# Altium project ife19_TS_BMS_MasterLTC6820.PrjPCB
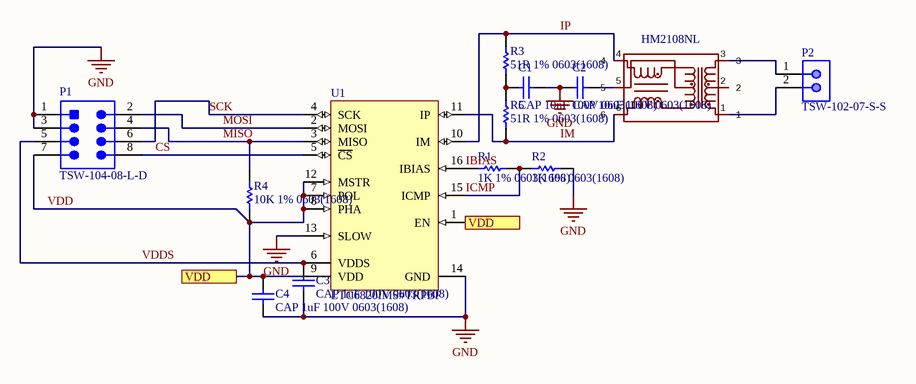
[diagram p0: ife19_TS_BMS_MasterLTC6820.SchDoc]
1 sheet, 13 parts. Net scope: flat (ports and power ports of the same name join across sheets).
Board file: ife19_TS_BMS_MasterLTC6820.PcbDoc

## Sheet ife19_TS_BMS_MasterLTC6820.SchDoc
size A

### Parts
1  HM2108NL  [HM2108NL]
C1  CAP 10nF 100V 0603(1608)  [CAPC0603(1608)100_M]
C2  CAP 10nF 100V 0603(1608)  [CAPC0603(1608)100_M]
C3  CAP 1uF 100V 0603(1608)  [CAPC0603(1608)100_M]
C4  CAP 1uF 100V 0603(1608)  [CAPC0603(1608)100_M]
P1  TSW-104-08-L-D  [SMTC-TSW-104-08-L-D_V]
P2  TSW-102-07-S-S  [SMTC-TSW-102-07-S-S]
R1  1K 1% 0603(1608)  [RESC0603(1608)_M]
R2  1K 1% 0603(1608)  [RESC0603(1608)_M]
R3  51R 1% 0603(1608)  [RESC0603(1608)_M]
R4  10K 1% 0603(1608)  [RESC0603(1608)_N]
R5  51R 1% 0603(1608)  [RESC0603(1608)_M]
U1  LTC6820IMS#TRPBF  [LT-MS-16_M]

### Ports
VDD

### Nets
GND: C1.2 C2.1 C3.1 C4.1 P1.1 P1.3 R2.2 U1.13(SLOW) U1.14(GND)
CS: P1.8 U1.5(~{CS})
IBIAS: R1.1 U1.16(IBIAS)
ICMP: R1.2 R2.1 U1.15(ICMP)
IM: 1.6 R5.1 U1.11(IP)
IP: 1.4 R3.1 U1.10(IM)
MISO: P1.4 R4.2 U1.3(MISO)
MOSI: P1.2 U1.2(MOSI)
SCK: P1.6 U1.4(SCK)
VDD: C4.2 P1.7 R4.1 U1.1(EN) U1.7(POL) U1.8(PHA) U1.9(VDD) U1.12(MSTR) ; port VDD
VDDS: C3.2 P1.5 U1.6(VDDS)
Net1_1: 1.1 P2.2
Net1_3: 1.3 P2.1
Net1_5: 1.5 C2.2
NetC1_1: C1.1 R3.2 R5.2

Not connected (* = marked no-connect by the designer): 1 2

### Library data of the parts
1 = HM2108NL: GateName_1: G$1; SymbolName_1: HM2108NL; LibraryName: Transformers and Chokes; DeviceSetName: HM2108NL; Package: HM2108NL
C1-C4 = CMP-1035-02326-1: CAP 10nF 100V ±20% 0603 (1608 Metric) Thickness 1mm SMD; Case-EIA: 0603; Tolerance: Â±20%; Case-Metric: 1608; Max Thickness: 1 mm; Technology: SMT; Value: 10nF; Rated Voltage: 100 V
P1 = CMP-1681-00006-3: Male Header, Pitch 2.54 mm, 2 x 4 Position, Height 8.38 mm, Tail Length 5.08 mm, -55 to 125 degC, RoHS, Bulk; Current Rating: 7.6 A; Voltage Rating: 550 V; Rows: 2; Lead Pitch: 0.1 inch; Colour: Black; REACH SVHC: No SVHC; Mounting Technology: Through Hole; RoHSCompliant: true; DatasheetVersion: 04/2012; Packaging: Bulk; Contact Material: Bronze; PackageReference: TSW-104-08-L-D; Pins: 8; Contact Plating: Gold; Contact Finish: Gold; Package Quantity: 1; PackageDescription: Male Header, Pitch 2.54 mm, 2 x 4 Position, Height 8.38 mm, Tail Length 5.08 mm; Mount: Through Hole
P2 = CMP-1681-00004-4: Male Header, Pitch 2.54 mm, 1 x 2 Position, Height 8.38 mm, Tail Length 2.54 mm, -55 to 125 degC, RoHS, Bulk; Manufacturer: Samtec; Rows: 1; ComponentLink1URL: http://www.samtec.com/; Contact Finish: Gold; Mounting Technology: Through Hole; PackageReference: TSW-102-07-S-S; RoHSCompliant: true; Pins: 2; Contact Material: Bronze; ComponentLink2Description: Datasheet; Max Operating Temperature: 125 degC; Min Operating Temperature: -55 degC; Height: 8.38 mm; Packaging: Bulk; ComponentLink1Description: Manufacturer URL; PackageDescription: Male Header, Pitch 2.54 mm, 1 x 2 Position, Height 8.38 mm, Tail Length 2.54 mm; Colour: Black; Contact Plating: Gold; Length: 5.08 mm; ComponentLink2URL: http://suddendocs.samtec.com/catalog_english/tsw_th.pdf; DatasheetVersion: 12/2015; Mount: Through Hole; Lead Pitch: 0.1 inch; REACH SVHC: No SVHC; Package Quantity: 1
R1 R2 = CMP-1012-00510-1: 1K 0.1W 1% 0603 (1608 Metric)  SMD; Case-Metric: 1608; Case-EIA: 0603; Value: 1000.00 Ohm; Technology: SMT; Tolerance: 1 %; Power: 0.1 W
R3 R5 = CMP-1012-00364-1: 51R 0.1W 1% 0603 (1608 Metric)  SMD; Value: 51.00 Ohm; Case-Metric: 1608; Case-EIA: 0603; Power: 0.1 W; Tolerance: 1 %; Technology: SMT
R4 = CMP-1012-00542-1: 2K 0.1W 1% 0603 (1608 Metric)  SMD; Case-EIA: 0603; Value: 2000.00 Ohm; Case-Metric: 1608; Power: 0.1 W; Technology: SMT; Tolerance: 1 %
U1 = CMP-0937-00011-1: IsoSPI Isolated Communication Interface, 2.7 to 5.5 V, -40 to 85 degC, 16-Pin MSOP (MS), Pb-Free, Tape and Reel; Manufacturer: Linear Technology; IO Supply Current: 1 uA Max.; Supply Current, IDLE State: 2 uA; IO Supply Voltage Range: 1.7 to 5.5 V; Receiver Input Resistance: 35 kOhm; VBIAS: 1.9 to 2.1 V; Packing: Tape and Reel; DatasheetVersion: Rev. A; PartNumber: LTC6820IMS#TRPBF; Mounting Technology: Surface Mount; ComponentLink2Description: Datasheet; ComponentLink3Description: Package Specification; ComponentLink1Description: Manufacturer URL; PackageVersion: Rev. A; Temperature Range (degC): -40 to 85; ComponentLink2URL: http://cds.linear.com/docs/en/datasheet/6820fa.pdf; Power Supply: 2.7 to 5.5 V; ComponentLink1URL: http://www.linear.com/; PackageDescription: 16-Pin Micro Small Outline Package, Body 4.039 x 3 mm, Pitch 0.5 mm; ComponentLink3URL: http://cds.linear.com/docs/en/packaging/05081669_A_MS16.pdf; PackageReference: MS-16